# Altium schematic sheet EPS_Topology.SchDoc: EPS Topology
size A3; DrawnBy: Sara V. Martinez; DocumentNumber: 3; Revision: V0.1; SheetNumber: 3; SheetTotal: 11; ImagePath: Flight
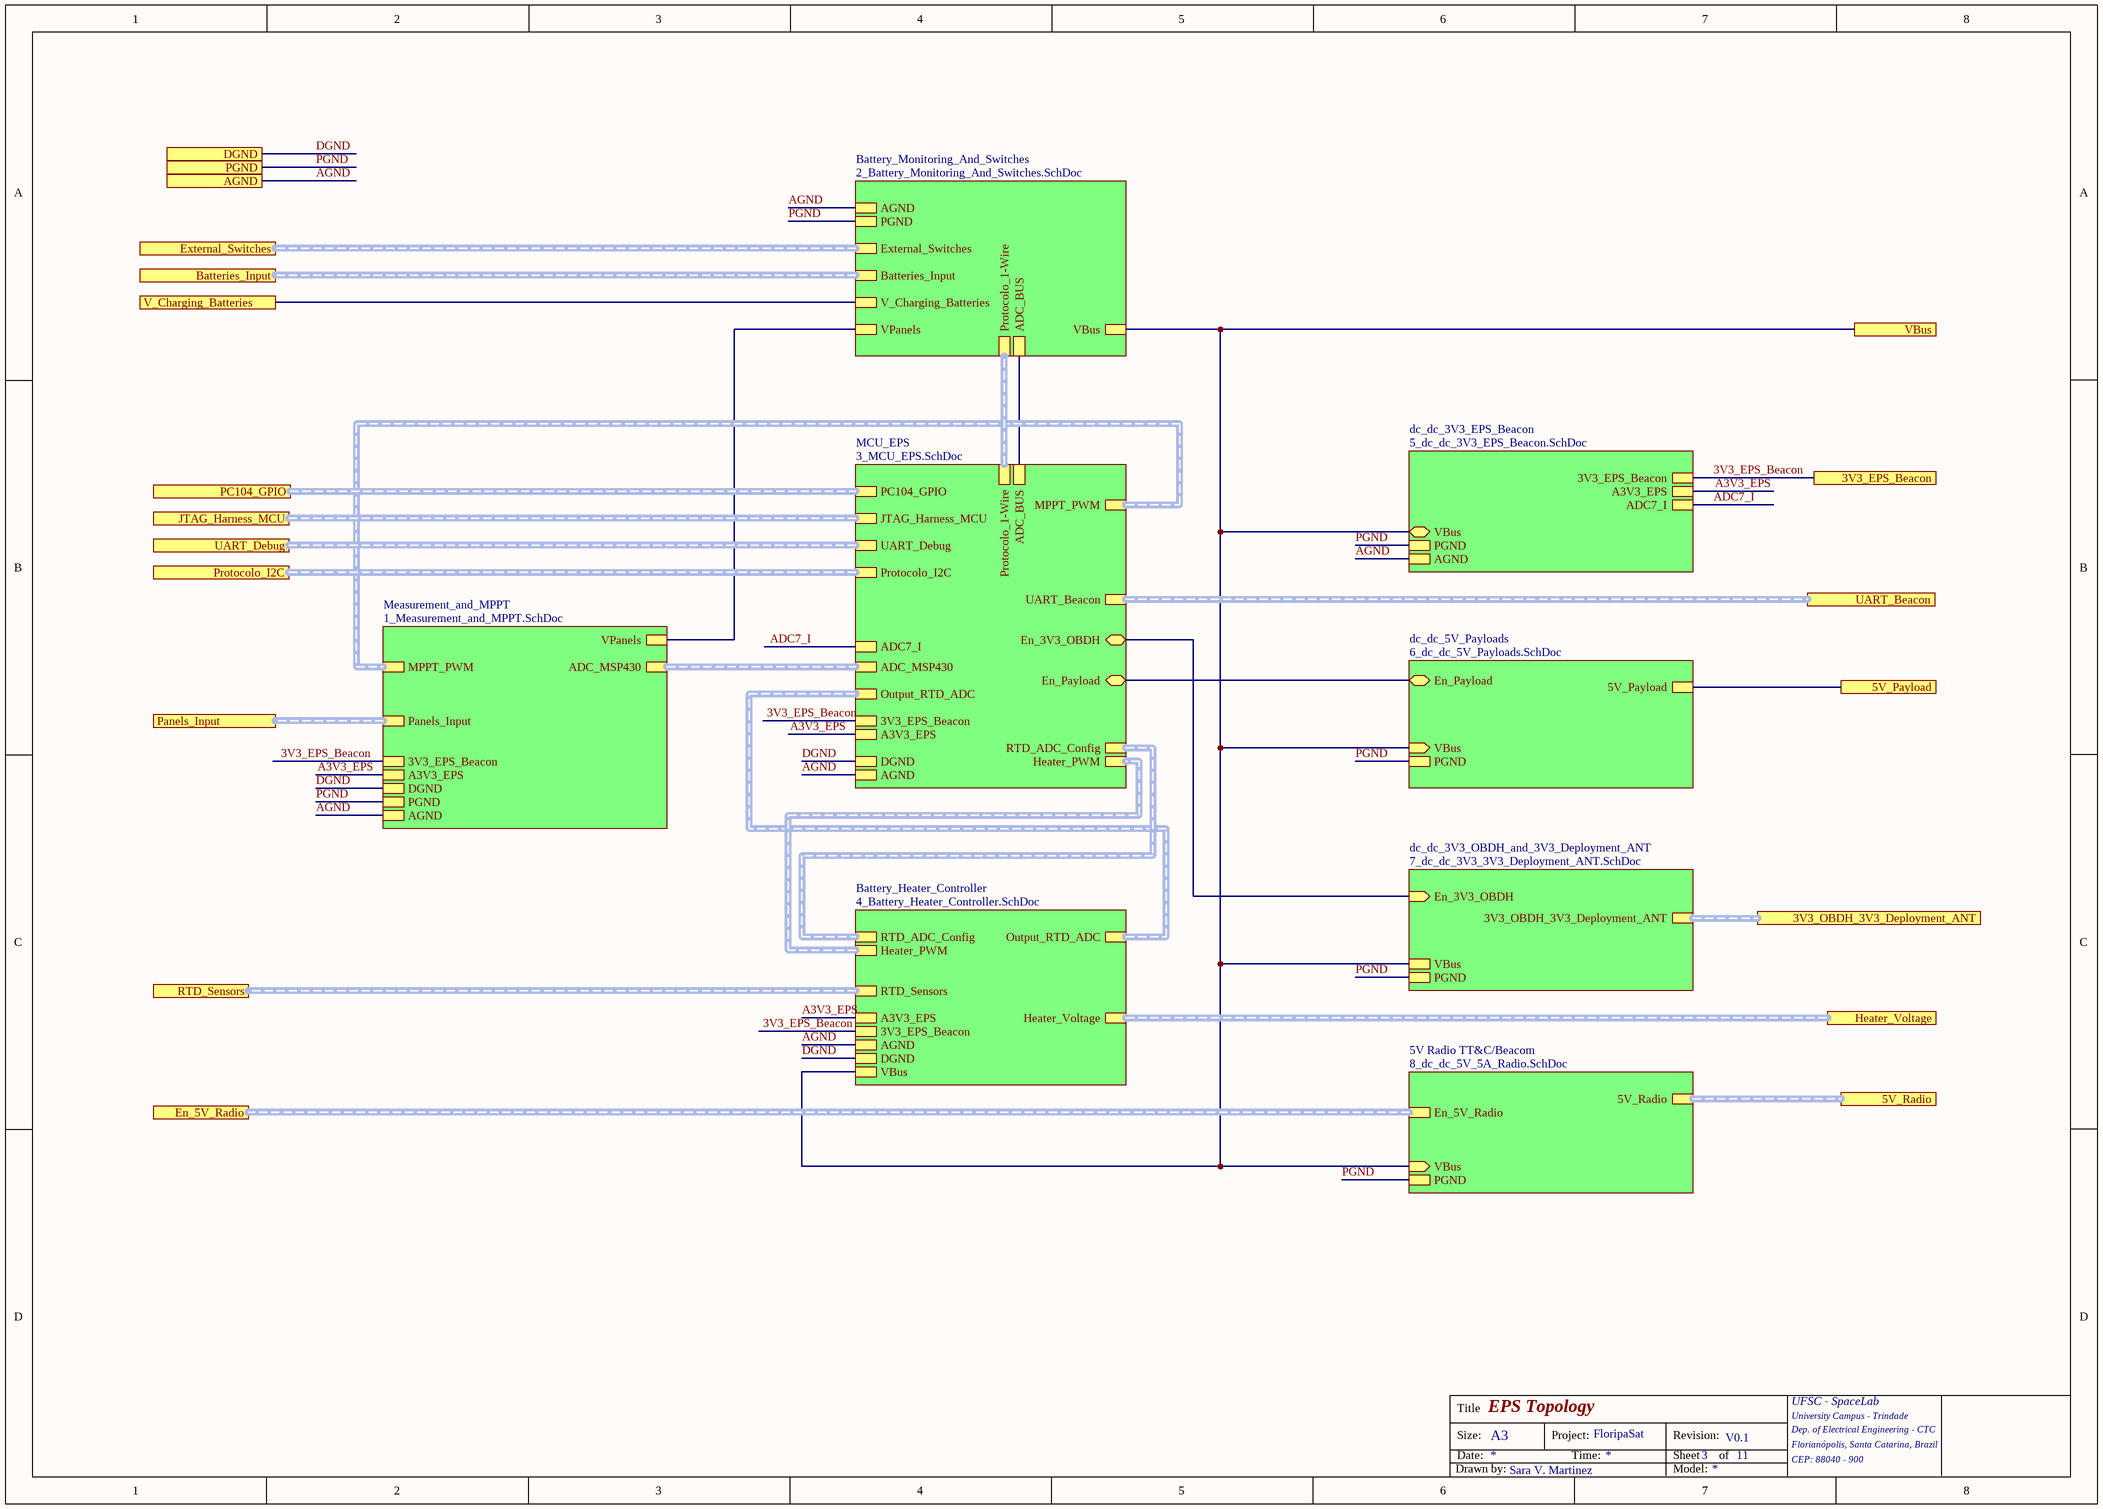
[diagram p0: EPS_Topology.SchDoc]

## Sub-sheets
5V Radio TT&C/Beacom = 8_dc_dc_5V_5A_Radio.SchDoc: PGND, VBus (in), 5V_Radio (harness 5V_Radio), En_5V_Radio (harness En_5V_Radio)
Battery_Heater_Controller = 4_Battery_Heater_Controller.SchDoc: Output_RTD_ADC (harness Output_RTD_ADC), RTD_ADC_Config (harness RTD_ADC_Config), Heater_PWM (harness Heater_PWM), Heater_Voltage (harness Heater_Voltage), RTD_Sensors (harness RTD_Sensors), 3V3_EPS_Beacon, VBus, DGND, AGND, A3V3_EPS
Battery_Monitoring_And_Switches = 2_Battery_Monitoring_And_Switches.SchDoc: VPanels, External_Switches (harness External_Switches), Batteries_Input (harness Batteries_Input), Protocolo_1-Wire (harness Protocolo_1-Wire), VBus, AGND, PGND, V_Charging_Batteries, ADC_BUS
dc_dc_3V3_EPS_Beacon = 5_dc_dc_3V3_EPS_Beacon.SchDoc: 3V3_EPS_Beacon, PGND, AGND, A3V3_EPS, ADC7_I, VBus (bidir)
dc_dc_3V3_OBDH_and_3V3_Deployment_ANT = 7_dc_dc_3V3_3V3_Deployment_ANT.SchDoc: VBus, 3V3_OBDH_3V3_Deployment_ANT (harness 3V3_OBDH_3V3_Deployment_ANT), PGND, En_3V3_OBDH (in)
dc_dc_5V_Payloads = 6_dc_dc_5V_Payloads.SchDoc: 5V_Payload, PGND, En_Payload (bidir), VBus (in)
MCU_EPS = 3_MCU_EPS.SchDoc: ADC_MSP430 (harness ADC_MSP430), Protocolo_1-Wire (harness Protocolo_1-Wire), MPPT_PWM (harness MPPT_PWM), En_Payload (bidir), 3V3_EPS_Beacon, Output_RTD_ADC (harness Output_RTD_ADC), RTD_ADC_Config (harness RTD_ADC_Config), JTAG_Harness_MCU (harness JTAG_Harness_MCU), UART_Debug (harness UART_Debug), Protocolo_I2C (harness Protocolo_I2C), DGND, AGND, A3V3_EPS, ADC_BUS, ADC7_I, En_3V3_OBDH (bidir), UART_Beacon (harness UART_Beacon), Heater_PWM (harness Harness), PC104_GPIO (harness PC104_GPIO)
Measurement_and_MPPT = 1_Measurement_and_MPPT.SchDoc: Panels_Input (harness Panels_Input), ADC_MSP430 (harness ADC_MSP430), VPanels, MPPT_PWM (harness MPPT_PWM), DGND, PGND, 3V3_EPS_Beacon, AGND, A3V3_EPS

## Ports
3V3_EPS_Beacon, 3V3_OBDH_3V3_Deployment_ANT (harness 3V3_OBDH_3V3_Deployment_ANT), 5V_Payload, 5V_Radio (harness 5V_Radio), AGND, Batteries_Input (harness Batteries_Input), DGND, En_5V_Radio (harness 5V_Radio), External_Switches (harness External_Switches), Heater_Voltage (harness Heater_Voltage), JTAG_Harness_MCU (harness JTAG_Harness_MCU), Panels_Input (harness Panels_Input), PC104_GPIO (harness PC104_GPIO), PGND, Protocolo_I2C (harness Protocolo_I2C), RTD_Sensors (harness RTD_Sensors), UART_Beacon (harness UART_Beacon), UART_Debug (harness UART_Debug), V_Charging_Batteries, VBus

## Nets
3V3_EPS_Beacon: port 3V3_EPS_Beacon, sheet Measurement_and_MPPT/3V3_EPS_Beacon, sheet MCU_EPS/3V3_EPS_Beacon, sheet dc_dc_3V3_EPS_Beacon/3V3_EPS_Beacon, sheet Battery_Heater_Controller/3V3_EPS_Beacon
5V_Payload: port 5V_Payload, sheet dc_dc_5V_Payloads/5V_Payload
A3V3_EPS: sheet Measurement_and_MPPT/A3V3_EPS, sheet MCU_EPS/A3V3_EPS, sheet dc_dc_3V3_EPS_Beacon/A3V3_EPS, sheet Battery_Heater_Controller/A3V3_EPS
ADC7_I: sheet MCU_EPS/ADC7_I, sheet dc_dc_3V3_EPS_Beacon/ADC7_I
AGND: port AGND, sheet Measurement_and_MPPT/AGND, sheet MCU_EPS/AGND, sheet dc_dc_3V3_EPS_Beacon/AGND, sheet Battery_Monitoring_And_Switches/AGND, sheet Battery_Heater_Controller/AGND
DGND: port DGND, sheet Measurement_and_MPPT/DGND, sheet MCU_EPS/DGND, sheet Battery_Heater_Controller/DGND
PGND: port PGND, sheet Measurement_and_MPPT/PGND, sheet dc_dc_5V_Payloads/PGND, sheet dc_dc_3V3_EPS_Beacon/PGND, sheet dc_dc_3V3_OBDH_and_3V3_Deployment_ANT/PGND, sheet 5V Radio TT&C/Beacom/PGND, sheet Battery_Monitoring_And_Switches/PGND
V_Charging_Batteries: port V_Charging_Batteries, sheet Battery_Monitoring_And_Switches/V_Charging_Batteries
VBus: port VBus, sheet dc_dc_5V_Payloads/VBus, sheet dc_dc_3V3_EPS_Beacon/VBus, sheet dc_dc_3V3_OBDH_and_3V3_Deployment_ANT/VBus, sheet 5V Radio TT&C/Beacom/VBus, sheet Battery_Monitoring_And_Switches/VBus, sheet Battery_Heater_Controller/VBus
(unnamed): sheet Measurement_and_MPPT/VPanels, sheet Battery_Monitoring_And_Switches/VPanels
(unnamed): sheet MCU_EPS/En_Payload, sheet dc_dc_5V_Payloads/En_Payload
(unnamed): sheet MCU_EPS/ADC_BUS, sheet Battery_Monitoring_And_Switches/ADC_BUS
(unnamed): sheet MCU_EPS/En_3V3_OBDH, sheet dc_dc_3V3_OBDH_and_3V3_Deployment_ANT/En_3V3_OBDH

## Buses and harness runs
harness port 3V3_OBDH_3V3_Deployment_ANT = sheet dc_dc_3V3_OBDH_and_3V3_Deployment_ANT/3V3_OBDH_3V3_Deployment_ANT
harness port 5V_Radio = sheet 5V Radio TT&C/Beacom/5V_Radio
harness port Batteries_Input = sheet Battery_Monitoring_And_Switches/Batteries_Input
harness port En_5V_Radio = sheet 5V Radio TT&C/Beacom/En_5V_Radio
harness port External_Switches = sheet Battery_Monitoring_And_Switches/External_Switches
harness port Heater_Voltage = sheet Battery_Heater_Controller/Heater_Voltage
harness port JTAG_Harness_MCU = sheet MCU_EPS/JTAG_Harness_MCU
harness port Panels_Input = sheet Measurement_and_MPPT/Panels_Input
harness port PC104_GPIO = sheet MCU_EPS/PC104_GPIO
harness port Protocolo_I2C = sheet MCU_EPS/Protocolo_I2C
harness port RTD_Sensors = sheet Battery_Heater_Controller/RTD_Sensors
harness port UART_Beacon = sheet MCU_EPS/UART_Beacon
harness port UART_Debug = sheet MCU_EPS/UART_Debug
harness sheet Battery_Heater_Controller/Heater_PWM = sheet MCU_EPS/Heater_PWM
harness sheet Battery_Heater_Controller/Output_RTD_ADC = sheet MCU_EPS/Output_RTD_ADC
harness sheet Battery_Heater_Controller/RTD_ADC_Config = sheet MCU_EPS/RTD_ADC_Config
harness sheet Battery_Monitoring_And_Switches/Protocolo_1-Wire = sheet MCU_EPS/Protocolo_1-Wire
harness sheet MCU_EPS/ADC_MSP430 = sheet Measurement_and_MPPT/ADC_MSP430
harness sheet MCU_EPS/MPPT_PWM = sheet Measurement_and_MPPT/MPPT_PWM

## Notes on the sheet
- Title
- Size:
- Date:
- A3
- Project:
- Time:
- FloripaSat
- Revision:
- Sheet
- of
- UFSC - SpaceLab
- University Campus - Trindade
- Dep. of Electrical Engineering - CTC
- Florianópolis, Santa Catarina, Brazil
- CEP: 88040 - 900
- Drawn by:
- Model: